# EAGLE design lcd_duffle_smd_mk_1 (EAGLE 6.5.0)
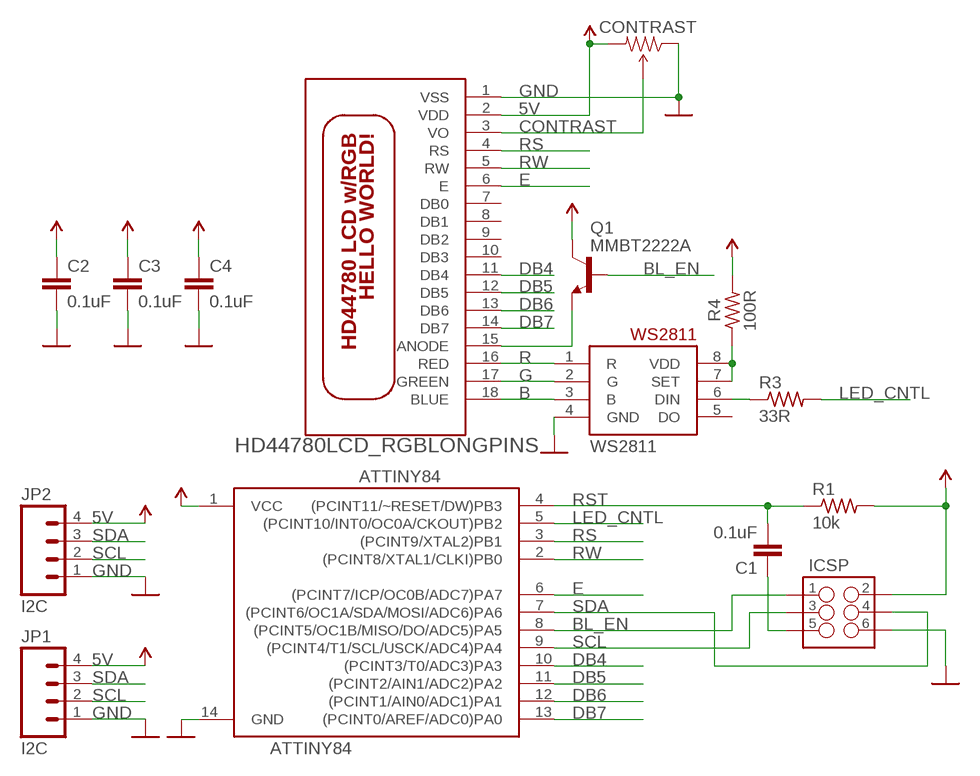
[diagram p0: schematic, sheet 1]

## Parts
ATTINY84  ATTINY84  [SO14]
C1  0.1uF  CAPACITOR-CERAMICC0603  [C0603]
C2  0.1uF  CAPACITOR-CERAMICC0603  [C0603]
C3  0.1uF  CAPACITOR-CERAMICC0603  [C0603]
C4  0.1uF  CAPACITOR-CERAMICC0603  [C0603]
CONTRAST  TRIMPOT  [TRIMPOT-5MM-V2]
ICSP  M03X2POGO_PINS  [2X3_POGO]
JP1  I2C  M04SMD_LONG  [1X04-SMD_LONG]
JP2  I2C  M04SMD_LONG  [1X04-SMD_LONG]
Q1  MMBT2222A  TRANSISTOR_NPNMMBT2222A  [SOT23-3]
R1  10k  RESISTORR0603  [R0603]
R3  33R  RESISTORR0603  [R0603]
R4  100R  RESISTORR0603  [R0603]
U$1  HD44780LCD_RGBLONGPINS  [LCD1602-RGB]
WS2811  WS2811-SOP8  [SO08-SKINNYPADS]

## Nets
5V: ATTINY84.1(VCC) C2.2 C3.2 C4.2 CONTRAST.C(CW) ICSP.P$2 JP1.4 JP2.4 Q1.3(C) R1.2 R4.2 U$1.2(VDD)
B: U$1.18(BLUE) WS2811.3(B)
BL_EN: ATTINY84.8((PCINT5/OC1B/MISO/DO/ADC5)PA5) ICSP.P$1 Q1.1(B)
CONTRAST: CONTRAST.B(WIPER) U$1.3(VO)
DB4: ATTINY84.10((PCINT3/T0/ADC3)PA3) U$1.11(DB4)
DB5: ATTINY84.11((PCINT2/AIN1/ADC2)PA2) U$1.12(DB5)
DB6: ATTINY84.12((PCINT1/AIN0/ADC1)PA1) U$1.13(DB6)
DB7: ATTINY84.13((PCINT0/AREF/ADC0)PA0) U$1.14(DB7)
E: ATTINY84.6((PCINT7/ICP/OC0B/ADC7)PA7) U$1.6(E)
G: U$1.17(GREEN) WS2811.2(G)
GND: ATTINY84.14(GND) C2.1 C3.1 C4.1 CONTRAST.A(CCW) ICSP.P$6 JP1.1 JP2.1 U$1.1(VSS) WS2811.4(GND)
LED_CNTL: ATTINY84.5((PCINT10/INT0/OC0A/CKOUT)PB2) R3.2
N$1: R3.1 WS2811.6(DIN)
N$2: R4.1 WS2811.7(SET) WS2811.8(VDD)
N$3: C1.1 ICSP.P$5
N$4: Q1.2(E) U$1.15(ANODE)
R: U$1.16(RED) WS2811.1(R)
RS: ATTINY84.3((PCINT9/XTAL2)PB1) U$1.4(RS)
RST: ATTINY84.4((PCINT11/~RESET/DW)PB3) C1.2 R1.1
RW: ATTINY84.2((PCINT8/XTAL1/CLKI)PB0) U$1.5(RW)
SCL: ATTINY84.9((PCINT4/T1/SCL/USCK/ADC4)PA4) ICSP.P$3 JP1.2 JP2.2
SDA: ATTINY84.7((PCINT6/OC1A/SDA/MOSI/ADC6)PA6) ICSP.P$4 JP1.3 JP2.3
Unconnected: U$1.7(DB0) U$1.8(DB1) U$1.9(DB2) U$1.10(DB3) WS2811.5(DO)

## Library data of the parts
ATTINY84 = SparkFun-DigitalIC:ATTINY84: Atmel 14-pin 2/4/8kB flash uC
C1-C4 = butts:CAPACITOR-CERAMIC: CAPACITOR, European symbol
CONTRAST = SparkFun-Electromechanical:TRIMPOT: Various small potentiometers for "set-and-forget" applications
ICSP = SparkFun-Connectors:M03X2: 2x3 .1" header. Shrouded, with keying- CONN-10681 SMT- CONN-11415 Pogo pins- HW-11044; PROD_ID: HW-11044
JP1 JP2 = SparkFun-Connectors:M04: Header 4 Standard 4-pin 0.1" header. Use with straight break away headers (SKU : PRT-00116), right angle break away headers (PRT-00553), swiss pins (PRT-00743), machine pins (PRT-00117), and female headers (PRT-00115). Molex polarized connector foot print use with SKU : PRT-08231 with associated crimp pins and housings. 1MM SMD Version SKU: PRT-10208
Q1 = butts:TRANSISTOR_NPN: Generic NPN BJT MMBT2222A - TRANS-08049 (SOT-23, 1A 40V) MPSA42 - TRANS-09116 (SOT-23, 500mA 300V) MMBT5088LT1G - TRANS-11160 (SOT-23, 50 mA 30V) BC547 - COM-08928 <http://www.sparkfun.com/products/8928> (TO-92 45V 100mA) (1.Collector 2.Base 3.Emitter) 2N3904 - COM-00521 <http://www.sparkfun.com/products/521> (TO-92 40V 200mA) (1.Emitter 2.Base 3.Collector) P2N2222A - COM-12852 <http://www.sparkfun.com/products/12852> (TO-92 40V 600mA) (1.Collector 2.Base 3.Emitter); PROD_ID: TRANS-08049
R1 R3 R4 = butts:RESISTOR: RESISTOR, American symbol
U$1 = adafruit:HD44780LCD_RGB
WS2811 = adafruit:WS2811

## Board
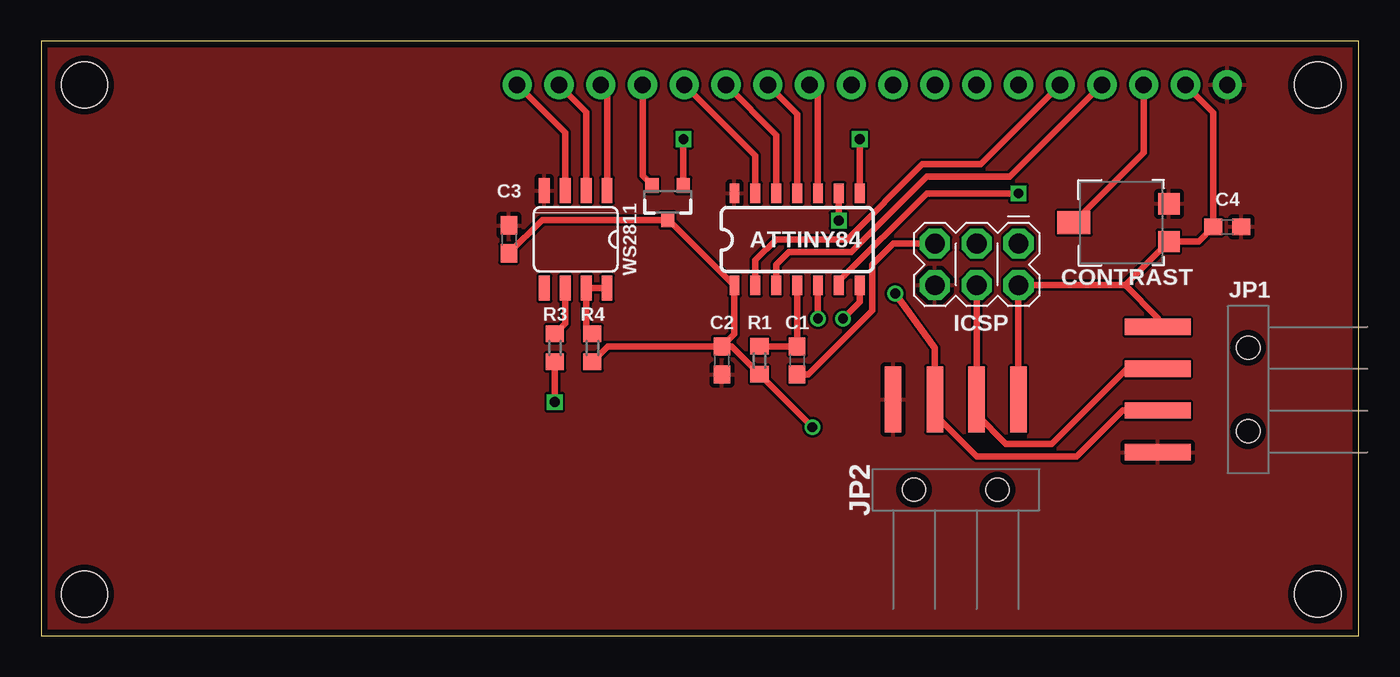
[diagram p1: board, top side]
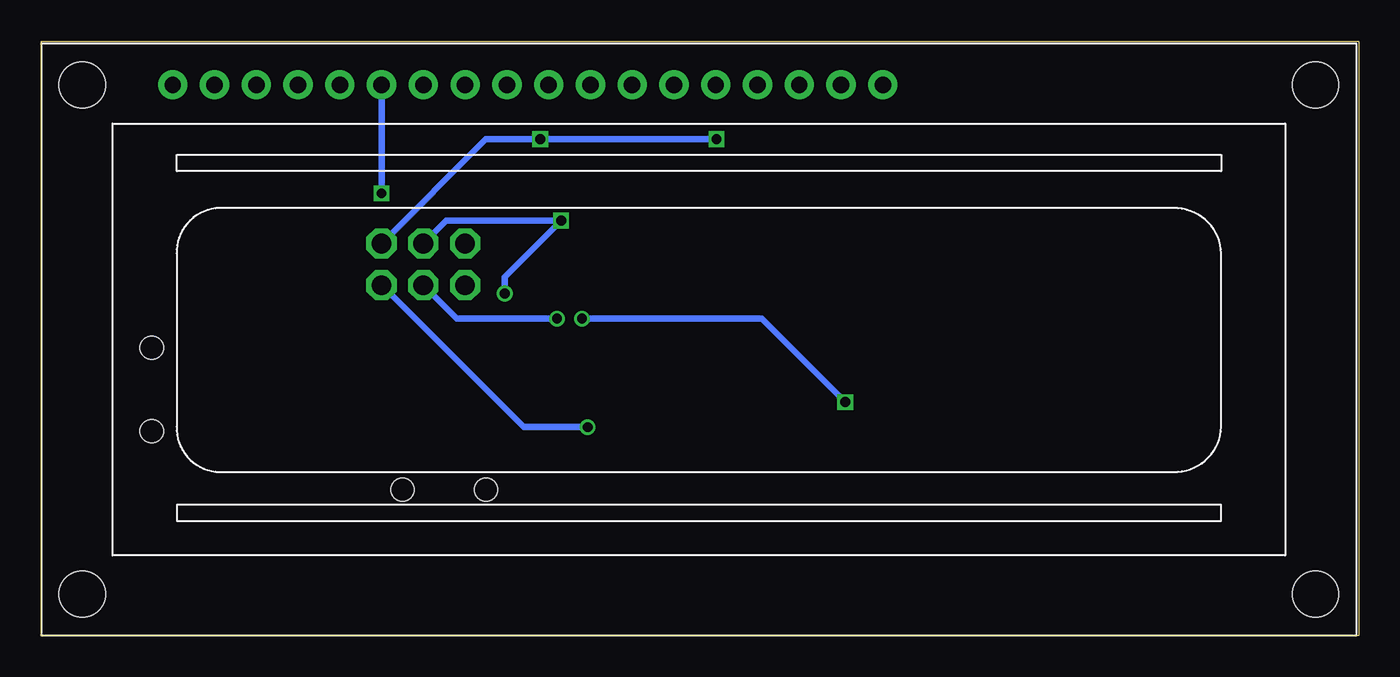
[diagram p2: board, bottom side, seen from below]

Size 80.14 x 36.2 mm. Coordinates in mm from the lower left corner, seen from the top.
Outline: 0,0 80.14,0 80.14,36.2 0,36.2 0,0
Copper layers (1*16): Top 0.0356mm / dielectric 1.5011mm / Bottom 0.0356mm
Design rules "LaenPCBOrder": minimum track width 6mil, minimum drill 13mil, track to track 6mil, track to pad 6mil, pad to pad 6mil, via to via 6mil, smd to smd 6mil, copper to edge 15mil, drill to drill 6mil, minimum pad ring 7mil, minimum via ring 7mil, stop-mask expansion 3mil, vias tented up to drill 0mil, thermal gap 10mil

### Footprints (pad centres in the part's own frame; a part is rotated, then mirrored left to right if it is on the bottom)
SO14 = smd 0.6 x 1.2: 1 -3.81,-2.8; 2 -2.54,-2.8; 3 -1.27,-2.8; 4 0,-2.8; 5 1.27,-2.8; 6 2.54,-2.8; 7 3.81,-2.8; 8 3.81,2.8; 9 2.54,2.8; 10 1.27,2.8; 11 0,2.8; 12 -1.27,2.8; 13 -2.54,2.8; 14 -3.81,2.8
C0603 = smd 1.1 x 1: 1 -0.85,0; 2 0.85,0
TRIMPOT-5MM-V2 = smd 1.3 x 1.3: A 1.15,-2.54; C -1.15,-2.54 | smd 1.402 x 2: B 0,3.239
2X3_POGO = drill 1.2 pad 1.829 octagon: P$1 0,0; P$2 0,2.54; P$3 2.54,0; P$4 2.54,2.54; P$5 5.08,0; P$6 5.08,2.54
1X04-SMD_LONG = smd 1 x 4: 1 -3.81,5.5; 2 -1.27,5.5; 3 1.27,5.5; 4 3.81,5.5 | hole 1.4: -2.54,0; 2.54,0
SOT23-3 = smd 0.8 x 0.9: 1 -0.95,-1; 2 0.95,-1; 3 0,1.1
R0603 = smd 1 x 1.1: 1 -0.85,0; 2 0.85,0
LCD1602-RGB = drill 1 pad 1.778: 1 -32,15.5; 2 -29.46,15.5; 3 -26.92,15.5; 4 -24.38,15.5; 5 -21.84,15.5; 6 -19.3,15.5; 7 -16.76,15.5; 8 -14.22,15.5; 9 -11.68,15.5; 10 -9.14,15.5; 11 -6.6,15.5; 12 -4.06,15.5; 13 -1.52,15.5; 14 1.02,15.5; 15 3.56,15.5; 16 6.1,15.5; 17 8.64,15.5; 18 11.18,15.5 | hole 2.8: -37.5,-15.5; -37.5,15.5; 37.5,15.5; 37.5,-15.5
SO08-SKINNYPADS = smd 0.66 x 1.524: 1 -1.905,-2.973; 2 -0.635,-2.973; 3 0.635,-2.973; 4 1.905,-2.973; 5 1.905,2.973; 6 0.635,2.973; 7 -0.635,2.973; 8 -1.905,2.973

### Placement (x,y rotation side)
ATTINY84  45.97,24.13 0 top
C1  45.97,16.76 90 top
C2  41.4,16.76 90 top
C3  28.45,24.13 270 top
C4  72.14,24.89 180 top
CONTRAST  66.04,25.15 90 top
ICSP  59.44,23.88 180 top
JP1  73.41,14.99 90 top
JP2  55.63,8.89 0 top
Q1  38.1,26.42 180 top
R1  43.69,16.76 270 top
R3  31.24,17.53 270 top
R4  33.53,17.53 270 top
U$1  40.13,18.03 0 bottom
WS2811  32.51,24.13 180 top

### Tracks (layer width: path | path; a pad name or v marks a point on that pad's centre or on a via)
5V  (via drill 0.6)
  Top 0.406: C2.2 42.16,18.38 ATTINY84.1 38.18,25.32 Q1.3 30.48,25.32 C3.2 | C2.2 41.99,17.61 R1.2 v46.9,12.7 | R4.2 34.47,17.61 C2.2 | JP2.4 ICSP.P$2 65.92,21.34 | 68.58,18.54 68.33,18.8 JP1.4 67.91,19.35 65.92,21.34 | U$1.2 71.29,31.84 C4.2 70.39,24 CONTRAST.C 65.92,21.34
  Bottom 0.406: v46.9,12.7 50.8,12.7 ICSP.P$2
B
  Top 0.406: U$1.18 31.88,30.61 WS2811.3
BL_EN  (via drill 0.6)
  Top 0.406: 39.12,27.48 Q1.1 39.05,30.21 v39.06,30.23 | 49.78,27.18 ATTINY84.8 v49.78,30.23
  Bottom 0.406: v39.06,30.23 v49.78,30.23 53.09,30.23 ICSP.P$1
CONTRAST
  Top 0.406: CONTRAST.B 67.05,29.4 U$1.3
DB4
  Top 0.406: U$1.11 47.24,33.02 ATTINY84.10
DB5
  Top 0.406: U$1.12 45.97,31.75 ATTINY84.11
DB6
  Top 0.406: U$1.13 44.7,30.48 ATTINY84.12
DB7
  Top 0.406: U$1.14 43.43,29.21 ATTINY84.13
E  (via drill 0.6)
  Top 0.406: ATTINY84.6 48.51,21.59 53.85,26.92 v59.44,26.92
  Bottom 0.406: U$1.6 v59.44,26.92
G
  Top 0.406: U$1.17 33.15,31.88 WS2811.2
GND
  pour Top: 0,0 0,36.2 80.26,36.2 80.26,0
LED_CNTL  (via drill 0.6)
  Top 0.406: R3.2 v31.24,14.22 | v47.24,19.3 ATTINY84.5
  Bottom 0.406: v47.24,19.3 36.32,19.3 v31.24,14.22
N$1
  Top 0.406: R3.1 31.88,19.01 WS2811.6
N$2
  Top 0.406: R4.1 33.15,18.76 WS2811.7 WS2811.8
N$3
  Top 0.406: C1.1 46.65,15.91 50.55,19.81 50.55,22.61 51.82,23.88 ICSP.P$5
N$4
  Top 0.406: U$1.15 36.57,27.99 Q1.2
R
  Top 0.406: U$1.16 34.42,33.15 WS2811.1
RS
  Top 0.406: ATTINY84.3 44.7,22.61 45.47,23.37 49.28,23.37 53.85,27.94 58.92,27.94 U$1.4
RST
  Top 0.406: ATTINY84.4 C1.2 R1.1
RW
  Top 0.406: ATTINY84.2 43.43,22.86 44.7,24.13 49.02,24.13 53.59,28.7 57.14,28.7 U$1.5
SCL  (via drill 0.6)
  Top 0.406: JP1.2 65.79,13.72 62.99,10.92 56.9,10.92 54.36,13.46 JP2.2 54.36,17.53 v51.94,20.83 | ATTINY84.9 v48.51,25.27
  Bottom 0.406: v51.94,20.83 51.94,21.84 v48.51,25.27 55.5,25.27 ICSP.P$3
SDA  (via drill 0.6)
  Top 0.406: JP1.3 66.04,16.26 61.47,11.68 58.67,11.68 56.9,13.46 JP2.3 ICSP.P$4 | v48.77,19.3 49.78,20.32 ATTINY84.7
  Bottom 0.406: ICSP.P$4 54.86,19.3 v48.77,19.3